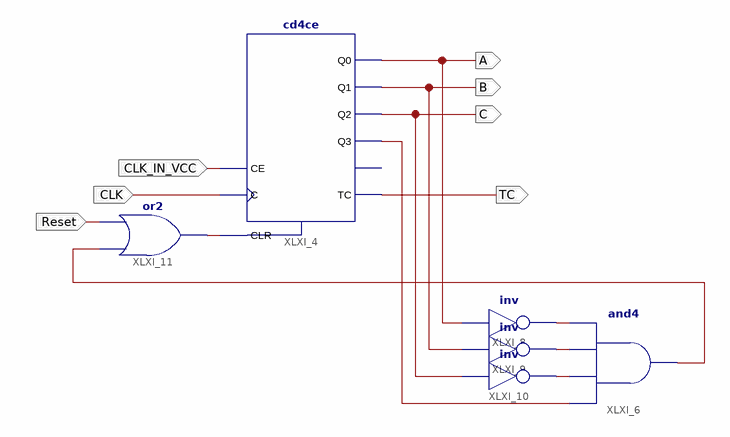
[diagram p0: schematic sheet 1]
// Xilinx ISE schematic Counter_0_to_7.sch (spartan6) as structural Verilog: 6 symbols, 7 ports
module Counter_0_to_7 (
  input  CLK,
  input  CLK_IN_VCC,
  input  Reset,
  output A,
  output B,
  output C,
  output TC
);

  wire XLXN_13, XLXN_14, XLXN_15, XLXN_41, XLXN_43, XLXN_44;

  cd4ce XLXI_4 (.C(CLK), .CE(CLK_IN_VCC), .CLR(XLXN_43), .Q0(A), .Q1(B), .Q2(C), .Q3(XLXN_41), .TC(TC));  // open: CEO
  not XLXI_8 (XLXN_13, A);
  not XLXI_9 (XLXN_14, B);
  not XLXI_10 (XLXN_15, C);
  and XLXI_6 (XLXN_44, XLXN_41, XLXN_15, XLXN_14, XLXN_13);
  or XLXI_11 (XLXN_43, XLXN_44, Reset);
endmodule
